# EasyEDA Pro project HNDX.eprj, schematic Schematic1_6
Board Name: 底板_4; Create Date: 2025-03-26; Page Name: P1; Project Name: GP; Schematic Name: Schematic1_6; Update Date: 2025-07-21; Company: 嘉立创EDA; Page Size: A4; Version: V1.0
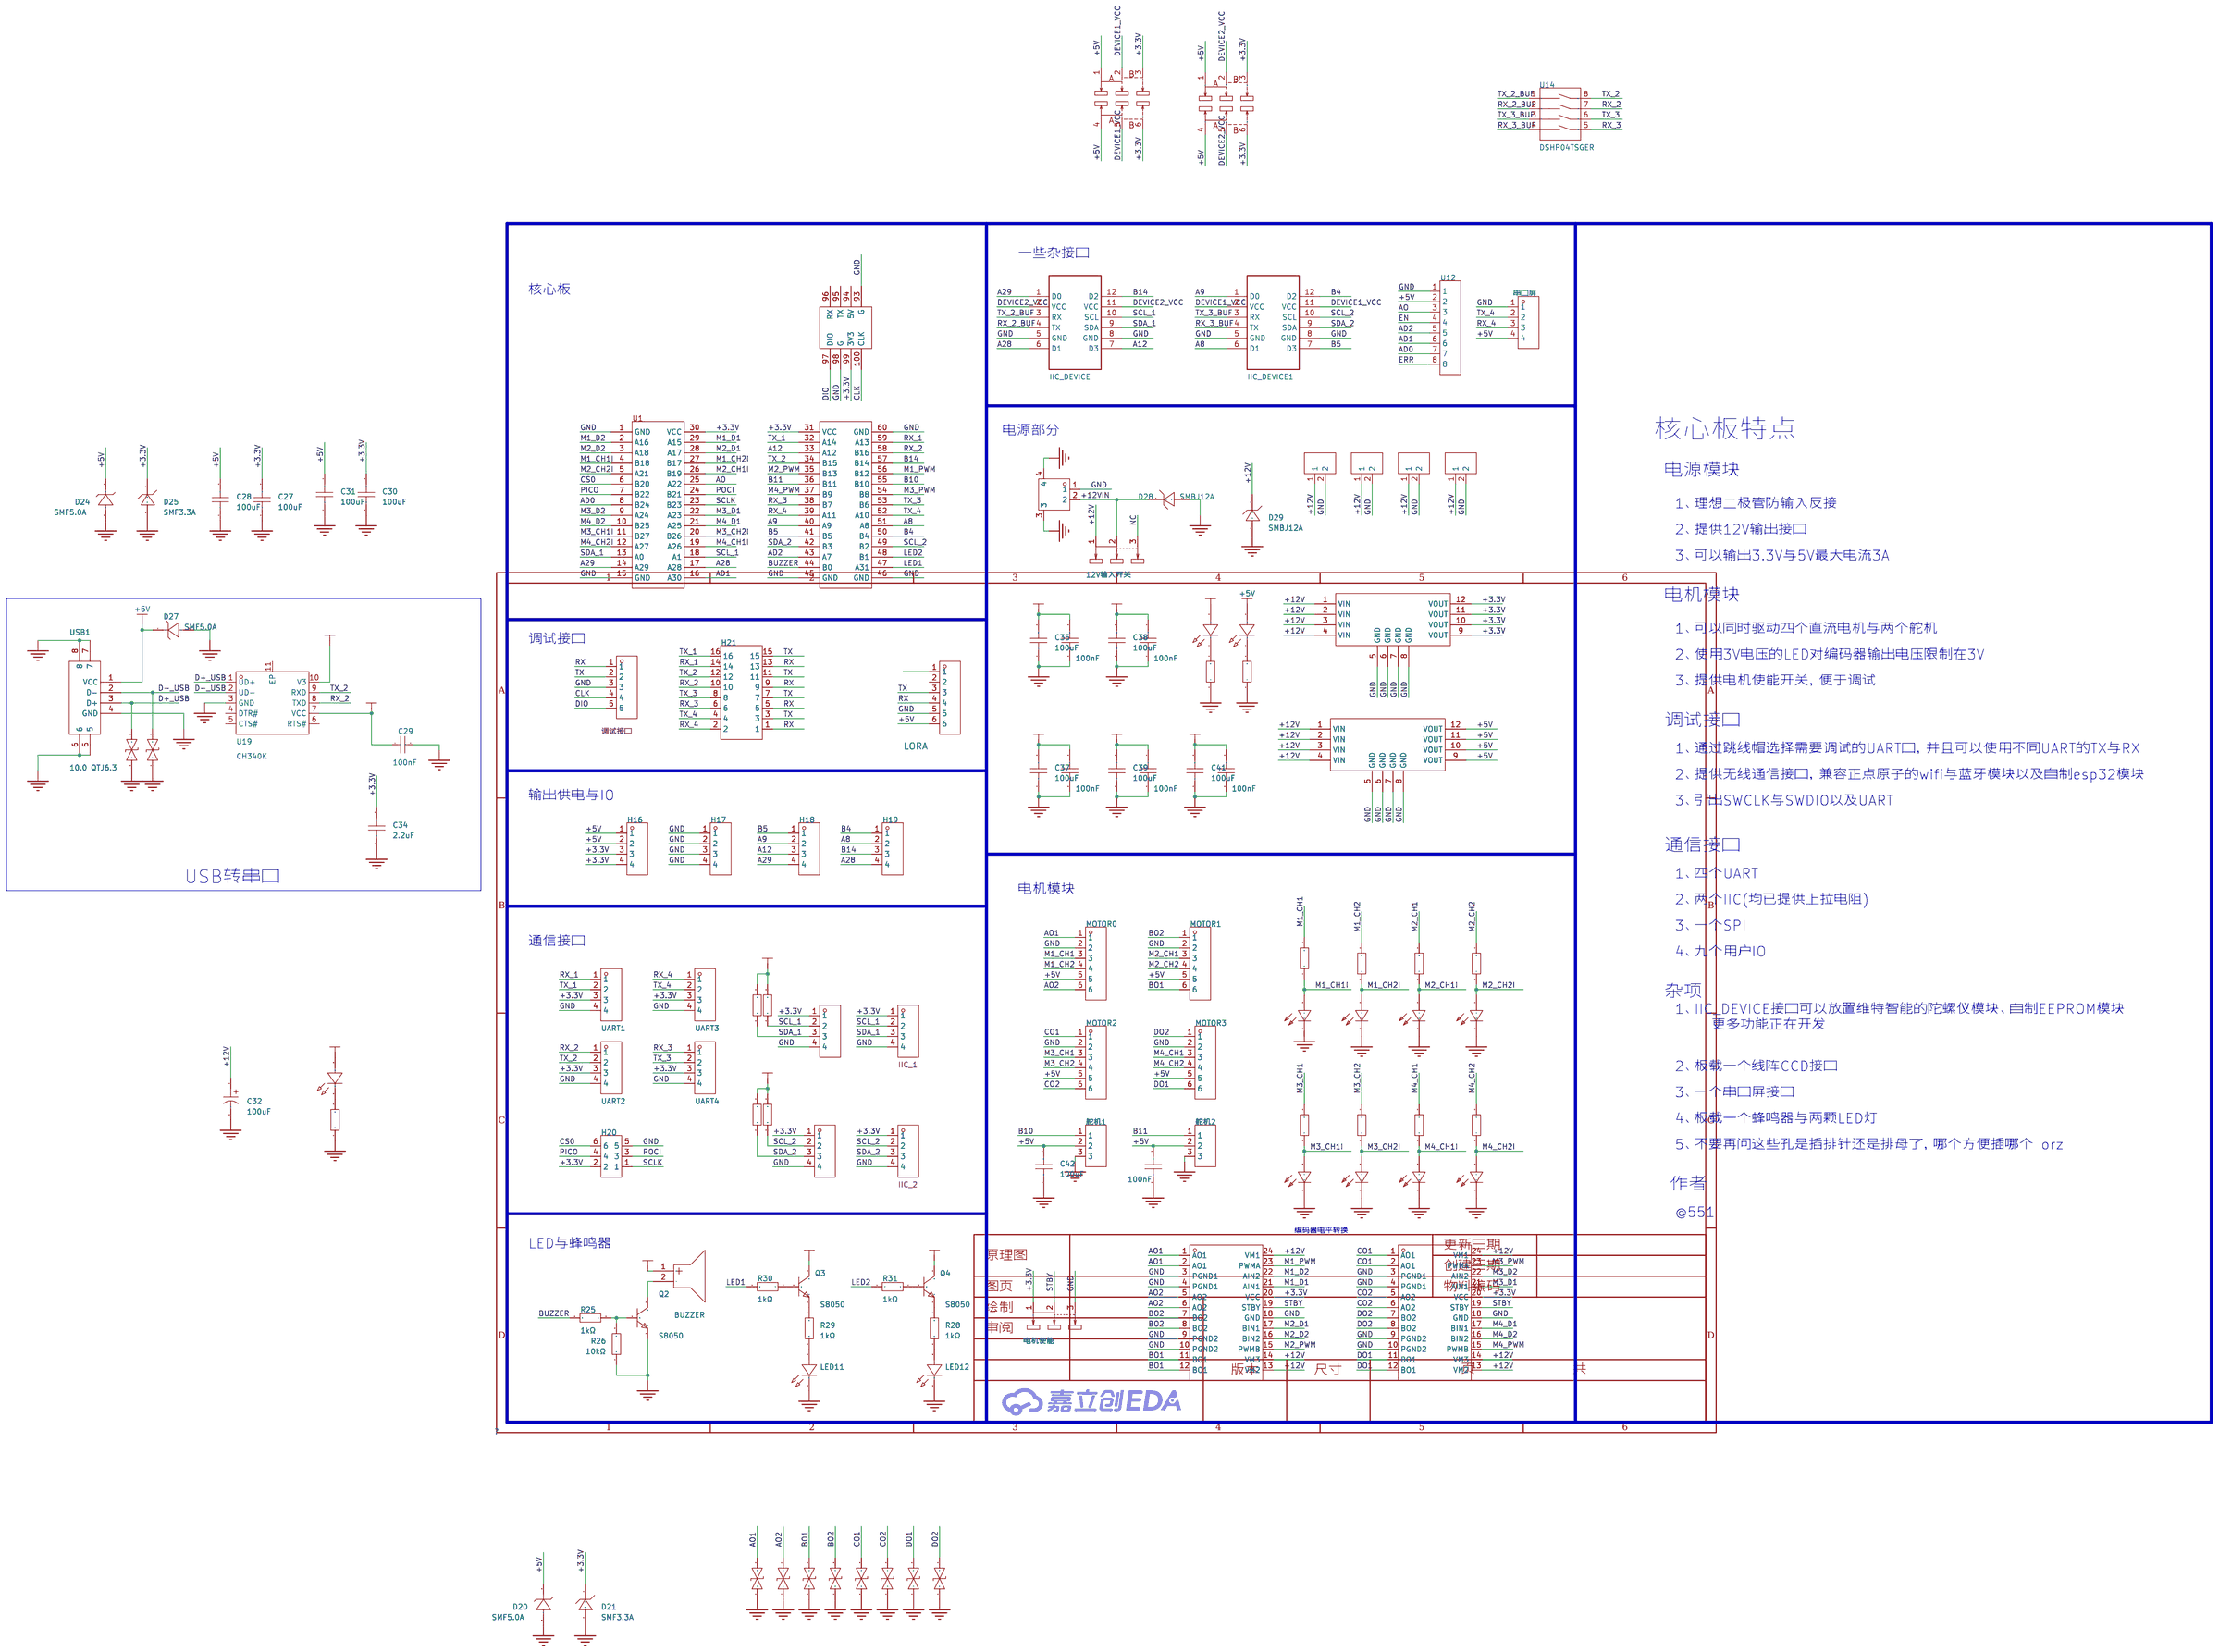
[diagram p4: schematic sheet]

## Parts
12V输入开关  SS-12D10L5  [SW-TH_SS-12D10L5]
BUZZER  2.7kHz  [BUZ-SMD_L9.6-W9.6-LS10.0-R]
C1  100nF  [C0603]
C7  100nF  [C0603]
C8  100nF  [C0603]
C11  100nF  [C0603]
C24  100nF  [C0603]
C26  100nF  [C0603]
C27  100uF  [C1210]
C28  100uF  [C1210]
C29  100nF  [C0603]
C30  100uF  [C1210]
C31  100uF  [C1210]
C32  100uF  [CAP-SMD_BD8.0-L8.3-W8.3-LS9.3-FD]
C34  2.2uF  [C0603]
C35  100uF  [C1210]
C37  100uF  [C1210]
C38  100uF  [C1210]
C39  100uF  [C1210]
C41  100uF  [C1210]
C42  100uF  [C1210]
CN1  XT30PW-M  [CONN-TH_XT30PW-M]
D7  0603ESDA-05N  [D0603-BI]
D20  SMF5.0A  [SOD-123FL_L2.7-W1.8-LS3.8-RD]
D21  SMF3.3A  [SOD-123_L2.8-W1.8-LS3.7-RD]
D24  SMF5.0A  [SOD-123FL_L2.7-W1.8-LS3.8-RD]
D25  SMF3.3A  [SOD-123_L2.8-W1.8-LS3.7-RD]
D26  0603ESDA-05N  [D0603-BI]
D27  SMF5.0A  [SOD-123FL_L2.7-W1.8-LS3.8-RD]
D28  SMBJ12A  [SMB_L4.3-W3.6-LS5.3-RD]
D29  SMBJ12A  [SMB_L4.3-W3.6-LS5.3-RD]
D30  SMF12CA  [SOD-123FL_L2.8-W1.8-LS3.7-BI]
D31  SMF12CA  [SOD-123FL_L2.8-W1.8-LS3.7-BI]
D33  SMF12CA  [SOD-123FL_L2.8-W1.8-LS3.7-BI]
D35  SMF12CA  [SOD-123FL_L2.8-W1.8-LS3.7-BI]
D36  SMF12CA  [SOD-123FL_L2.8-W1.8-LS3.7-BI]
D37  SMF12CA  [SOD-123FL_L2.8-W1.8-LS3.7-BI]
D38  SMF12CA  [SOD-123FL_L2.8-W1.8-LS3.7-BI]
D39  SMF12CA  [SOD-123FL_L2.8-W1.8-LS3.7-BI]
H1  UART2  [HDR-TH_4P-P2.54-V-M]
H2  UART1  [HDR-TH_4P-P2.54-V-M]
H8  UART3  [HDR-TH_4P-P2.54-V-M]
H9  UART4  [HDR-TH_4P-P2.54-V-M]
H11  PZ254V-11-04P  [HDR-TH_4P-P2.54-V-M]
H12  IIC_1  [HDR-TH_4P-P2.54-V-M]
H13  PZ254V-11-04P  [HDR-TH_4P-P2.54-V-M]
H14  IIC_2  [HDR-TH_4P-P2.54-V-M]
H16  PZ254V-11-04P  [HDR-TH_4P-P2.54-V-M]
H17  PZ254V-11-04P  [HDR-TH_4P-P2.54-V-M]
H18  PZ254V-11-04P  [HDR-TH_4P-P2.54-V-M]
H19  PZ254V-11-04P  [HDR-TH_4P-P2.54-V-M]
H20  PH2.54-07-03PWS  [HDR-TH_6P-P2.54-H-M-R2-C3-S2.54-W12.3-N]
H21  PZ254R-12-16P  [HDR-TH_16P-P2.54-H-M-R2-C8-S2.54]
IIC_DEVICE  -  [TUOLUOYI]
IIC_DEVICE1  -  [TUOLUOYI]
LED1  NCD0603R1  [LED0603-RD_RED]
LED2  NCD0603R1  [LED0603-RD_RED]
LED3  NCD0603R1  [LED0603-RD_RED]
LED4  NCD0603R1  [LED0603-RD_RED]
LED5  NCD0603R1  [LED0603-RD_RED]
LED6  NCD0603R1  [LED0603-RD_RED]
LED7  NCD0603R1  [LED0603-RD_RED]
LED8  NCD0603R1  [LED0603-RD_RED]
LED9  XL-1608UGC-04  [LED0603-RD_GREEN]
LED10  XL-1608UGC-04  [LED0603-RD_GREEN]
LED11  XL-3216SURC  [LED1206-R-RD_RED]
LED12  XL-3216SURC  [LED1206-R-RD_RED]
LED13  XL-1608UGC-04  [LED0603-RD_GREEN]
LORA  -  [HDR-TH_6P-P2.54-V-M]
MOTOR0  HX25003-6WAP  [CONN-TH_6P-P2.50_HX25003-6WAP]
MOTOR1  HX25003-6WAP  [CONN-TH_6P-P2.50_HX25003-6WAP]
MOTOR2  HX25003-6WAP  [CONN-TH_6P-P2.50_HX25003-6WAP]
MOTOR3  HX25003-6WAP  [CONN-TH_6P-P2.50_HX25003-6WAP]
Q2  S8050  [SOT-23-3_L2.9-W1.3-P1.90-LS2.3-BR]
Q3  S8050  [SOT-23-3_L2.9-W1.3-P1.90-LS2.3-BR]
Q4  S8050  [SOT-23-3_L2.9-W1.3-P1.90-LS2.3-BR]
R3  1k  [R0603]
R4  1k  [R0603]
R5  1k  [R0603]
R6  1k  [R0603]
R7  1k  [R0603]
R8  1k  [R0603]
R9  1k  [R0603]
R10  1k  [R0603]
R19  1kΩ  [R0603]
R20  1kΩ  [R0603]
R21  1kΩ  [R0603]
R22  1kΩ  [R0603]
R23  1k  [R0603]
R24  1k  [R0603]
R25  1kΩ  [R0603]
R26  10kΩ  [R0603]
R28  1kΩ  [R0603]
R29  1kΩ  [R0603]
R30  1kΩ  [R0603]
R31  1kΩ  [R0603]
R32  1k  [R0603]
SW2  MST22D18G2  [SW-SMD_MST22D18G2]
SW3  MST22D18G2  [SW-SMD_MST22D18G2]
U1  -  [mspm0gp]
U2  TB6612FNG(O,C,8,EL  [SSOP-24_L8.4-W5.8-P0.65-LS7.8-BL]
U3  TB6612FNG(O,C,8,EL  [SSOP-24_L8.4-W5.8-P0.65-LS7.8-BL]
U6  调试接口  [HDR-TH_5P-P2.54-V-M]
U10  -  [电源模块]
U11  -  [电源模块]
U12  BX-XH2.54-8PWZ  [CONN-TH_8P-P2.50_BX-XH2.54-8PWZ]
U14  DSHP04TSGER  [SW-SMD_8P-L6.7-W5.4-P1.27-LS8.4]
U15  DB125-2.54-2P-GN-S  [CONN-TH_DB125-2.54-2P-GN]
U16  DB125-2.54-2P-GN-S  [CONN-TH_DB125-2.54-2P-GN]
U17  DB125-2.54-2P-GN-S  [CONN-TH_DB125-2.54-2P-GN]
U18  DB125-2.54-2P-GN-S  [CONN-TH_DB125-2.54-2P-GN]
U19  CH340K  [ESOP-10_L4.9-W3.9-P1.00-LS6.2-BL-EP]
USB1  10.0 QTJ6.3  [USB-A-SMD_10.0-QTJ6.3]
串口屏  HX25003-4A  [CONN-TH_4P-P2.50_HX25003-4A]
电机使能  SS-12D10L5  [SW-TH_SS-12D10L5]
舵机1  PZ254V-11-03P  [HDR-TH_3P-P2.54-V-M]
舵机2  PZ254V-11-03P  [HDR-TH_3P-P2.54-V-M]

## Library data of the parts
12V输入开关 电机使能 = SS-12D10L5: 电路结构:单刀双掷;安装方式:直插;开关颜色:黑色;额定电流(DC):3A;额定电压(DC):125V;额定电流(AC):3A;额定电压(AC):125V;机械寿命:1万次;; LCSC Part Name: 柄长5mm 直插双档 滑动开关; Supplier Part: C319012; Manufacturer: XKB Connectivity(中国星坤); Supplier Footprint: 插件; JLCPCB Part Class: 扩展库; Datasheet: https://atta.szlcsc.com/upload/public/pdf/source/20211009/D6412F37AABE6F9459A6EE7FA4DAEADB.pdf; Supplier: LCSC; Circuit: 单刀双掷; Actuator Style: 矩形柱状; Pin Style: PC引脚; Switch Length: 13mm; Switch Width: 6.8mm; Switch Height: 6.4mm; Mounting Style: 直插; Actuator Color: 黑色; Current Rating (DC): 3A; Voltage Rating (DC): 125V; Current Rating (AC): 3A; Voltage Rating (AC): 125V; Mechanical Life: 1万次; Operating Temperature: -40℃~+85℃
BUZZER = YS-SBZ9650DYB05: LCSC Part Name: 贴片有源蜂鸣器5V; Supplier Part: C409830; Manufacturer: Fengming(锋鸣电子); Supplier Footprint: SMD,9.6x9.6mm; JLCPCB Part Class: 扩展库; Datasheet: https://atta.szlcsc.com/upload/public/pdf/source/20191217/C409830_8EC3C70066086F723D62F9967ED58A07.pdf; Supplier: LCSC; Oscillator Circuit: 有源(内含驱动线路); Operating Voltage: 3V~7V; Sound Pressure Level (SPL): 80dB@5V,10cm; Length: 9.6mm; Width: 9.6mm; Height: 5.3mm
C1 C7 C8 C11 C24 C26 = CGA0603X7R104K500JT: LCSC Part Name: 100nF ±10% 50V; Supplier Part: C6119867; Manufacturer: HRE(芯声); Supplier Footprint: 0603; JLCPCB Part Class: 扩展库; Supplier: LCSC; Tolerance: ±10%; Voltage Rated: 50V; Temperature Coefficient: X7R
C27 C28 C30 C31 C35 C37-C39 C41 C42 = GRM32ER61A107ME20L: LCSC Part Name: 100uF ±20% 10V; Supplier Part: C84455; Manufacturer: muRata(村田); Supplier Footprint: 1210; JLCPCB Part Class: 扩展库; Datasheet: https://atta.szlcsc.com/upload/public/pdf/source/20180228/C84455_15198056002791377611.pdf; Supplier: LCSC; Tolerance: ±20%; Voltage Rated: 10V; Temperature Coefficient: X5R
C29 = CAP_0603: Supplier Footprint: 0603
C32 = MA50V100M8X12: LCSC Part Name: 100uF ±20% 50V; Supplier Part: C46550475; Manufacturer: 捷而瑞; Supplier Footprint: SMD,D8xL12mm; JLCPCB Part Class: 扩展库; Datasheet: https://atta.szlcsc.com/upload/public/pdf/source/20250508/042504A8A2EFB60B30B9FCDBA41DB211.pdf; Supplier: LCSC; Tolerance: ±20%; Voltage Rating: 50V; Ripple Current: 3.1A@100Hz; Equivalent Series Resistance(ESR): 25mΩ@100kHz; Diameter: 8mm; Lifetime: 2000hrs@105℃; Operating Temperature: -55℃~+105℃
C34 = CL10A225KB8NNNC: 容值:2.2uF;精度:±10%;额定电压:50V;材质(温度系数):X5R;; LCSC Part Name: 2.2uF ±10% 50V; Supplier Part: C913904; Manufacturer: SAMSUNG(三星); Supplier Footprint: 0603; JLCPCB Part Class: 扩展库; Datasheet: https://atta.szlcsc.com/upload/public/pdf/source/20160218/1457707763339.pdf; Supplier: LCSC; Tolerance: ±10%; Voltage Rated: 50V; Temperature Coefficient: X5R
CN1 = XT30PW-M: LCSC Part Name: XT30PW-M公头; Supplier Part: C431092; Manufacturer: AMASS(艾迈斯); Supplier Footprint: Through Hole; JLCPCB Part Class: Extended Part; Datasheet: https://atta.szlcsc.com/upload/public/pdf/source/20220222/6A9F22F7850E25B33E1BE430ADF8560B.pdf; Supplier: LCSC
D7 D26 = 0603ESDA-05N: LCSC Part Name: 双向ESD; Supplier Part: C316054; Manufacturer: BORN(伯恩半导体); Supplier Footprint: 0603; JLCPCB Part Class: 扩展库; Datasheet: https://atta.szlcsc.com/upload/public/pdf/source/20200528/C316054_1CC523E9CE69E41C8DD5A05C832CCD1A.pdf; Supplier: LCSC; polarity: 双向; Reverse Stand-Off Voltage (Vrwm): 5V; Maximum Clamping Voltage: 50V; Type: ESD
D20 D24 D27 = SMF5.0A_C19077497: Supplier Part: C19077497; Manufacturer: 宏迦橙; Supplier Footprint: SOD-123FL; JLCPCB Part Class: 扩展库; Datasheet: https://atta.szlcsc.com/upload/public/pdf/source/20231129/4813F17DC56F8B344A8D004597B3633C.pdf; Supplier: LCSC; polarity: 单向; Reverse Stand-Off Voltage (Vrwm): 5V; Maximum Clamping Voltage: 7.3V; Peak Pulse Current (Ipp): 27.4A; Peak Pulse Power Dissipation (Ppp): 200W; Breakdown Voltage: 6.4V; Reverse Leakage Current (Ir): 400uA; Number of Lines: 单路; Operating Temperature: -55℃~+155℃; Type: TVS
D21 D25 = SMF3.3A_C283866: Supplier Part: C283866; Manufacturer: DOWO(东沃); Supplier Footprint: SOD-123FL; JLCPCB Part Class: 扩展库; Datasheet: https://atta.szlcsc.com/upload/public/pdf/source/20240321/1BA336232F2D97E4B026619682DB80D3.pdf; Supplier: LCSC; Reverse Stand-Off Voltage (Vrwm): 3.3V; Maximum Clamping Voltage: 8V; Peak Pulse Current (Ipp)@10/1000us: 25A; Breakdown Voltage: 5.2V; Reverse Leakage Current (Ir): 600uA; Type: TVS
D28 D29 = SMBJ12A_C19077565: Supplier Part: C19077565; Manufacturer: 宏嘉诚; Supplier Footprint: SMB; JLCPCB Part Class: 扩展库; Datasheet: https://atta.szlcsc.com/upload/public/pdf/source/20250107/474F05451FC8AB27D7FA0238914F96F6.pdf; Supplier: LCSC; Polarity: 单向; Reverse Stand-Off Voltage (Vrwm): 12V; Clamping Voltage: 19.9V; Peak Pulse Current (Ipp): 30.15A; Peak Pulse Power Dissipation (Ppp): 600W; Voltage - Breakdown: 14.7V; Reverse Leakage Current (Ir): 5uA; Type: TVS
D30 D31 D33 D35-D39 = SMF12CA_C19077507: Supplier Part: C19077507; Manufacturer: 宏迦橙; Supplier Footprint: SOD-123FL; JLCPCB Part Class: 扩展库; Datasheet: https://atta.szlcsc.com/upload/public/pdf/source/20231129/4813F17DC56F8B344A8D004597B3633C.pdf; Supplier: LCSC; polarity: 双向; Reverse Stand-Off Voltage (Vrwm): 12V; Maximum Clamping Voltage: 19.9V; Peak Pulse Current (Ipp)@10/1000us: 10.1A; Peak Pulse Power Dissipation (Ppp)@10/1000us: 200W; Breakdown Voltage: 14.7V; Reverse Leakage Current (Ir): 2.5uA; Operating Temperature: -55℃~+155℃; Type: TVS
H1 H2 H8 H9 H11-H14 H16-H19 = PZ254V-11-04P: 插针结构:1x4P;间距:2.54mm;行距:-;圆针/方针:方针;安装类型:直插;排数:单排;总PIN位数:4P;额定电流:3A;额定电压:250V;配合针长度:6mm;塑高:2.5mm;端接针长度:3mm;触头材质:-;工作温度范围:-40℃~+105℃;颜色:黑色;; LCSC Part Name: 间距:2.54mm 1x4P 直插 方针; Supplier Part: C2691448; Manufacturer: XFCN(兴飞); Supplier Footprint: 插件,P=2.54mm; JLCPCB Part Class: 扩展库; Datasheet: https://atta.szlcsc.com/upload/public/pdf/source/20200309/C492403_F9F19131791D08044AD4F84F8E751A34.pdf; Supplier: LCSC; Pin Structure: 1x4P; Pitch: 2.54mm; Circluar Pins/Square Pins: 方针; Mounting Type: 直插; Number of Rows: 单排; Number of Pins: 4P; Current Rating (Max): 3A; Voltage Rating (Max): 250V; Length of Mating Pin: 6mm; Insulation Height: 2.5mm; Length of End Connection Pin: 3mm; Operating Temperature Range: -40℃~+105℃; Color: 黑色
H20 = PH2.54-07-03PWS: LCSC Part Name: 2x3P 间距:2.54mm 方针 弯插; Supplier Part: C7501617; Manufacturer: XUNPU(讯普); Supplier Footprint: 弯插,P=2.54mm; JLCPCB Part Class: 扩展库; Datasheet: https://atta.szlcsc.com/upload/public/pdf/source/20241122/C715A738E7C0FD419A695A197092155B.pdf; Supplier: LCSC; Pin Structure: 2x3P; Pitch: 2.54mm; Circluar Pins/Square Pins: 方针; Mounting Type: 弯插; Number of Rows: 双排; Number of Pins: 6P; Length of Mating Pin: 6mm; Insulation Height: 2.5mm; Contact Material: 黄铜; Operating Temperature: -40℃~+105℃; Color: 黑色
H21 = PZ254R-12-16P: LCSC Part Name: 2x8P 间距:2.54mm 方针 弯插; Supplier Part: C492436; Manufacturer: XFCN(兴飞); Supplier Footprint: 弯插,P=2.54mm; JLCPCB Part Class: 扩展库; Datasheet: https://atta.szlcsc.com/upload/public/pdf/source/20200309/C492436_DD2BC8C297EFC04522424EFF5C609A1B.pdf; Supplier: LCSC; Pin Structure: 2x8P; Pitch: 2.54mm; Row Spacing: 2.54mm; Circluar Pins/Square Pins: 方针; Mounting Type: 弯插; Number of Rows: 双排; Number of Pins: 16P; Length of Mating Pin: 6mm; Insulation Height: 2.5mm; Contact Material: 黄铜; Operating Temperature: -40℃~+105℃; Color: 黑色
IIC_DEVICE IIC_DEVICE1 = TUOLUOYI: _: undefined
LED1-LED8 = NCD0603R1_C84263: 灯头类型:-;发光颜色:红色;正向电压(VF):1.6V~2.6V;功率:65mW;正向电流:20mA;主波长:615nm~630nm;二极管配置:独立二极管;透镜颜色:无色透明透镜;色温:-;发光强度:80mcd~220mcd;发光角度:130°;载带方式:-;工作温度:-30℃~+85℃;; Supplier Part: C84263; Manufacturer: 国星光电; Supplier Footprint: 0603; JLCPCB Part Class: 扩展库; Datasheet: https://atta.szlcsc.com/upload/public/pdf/source/20200820/C84263_DABC6A75E58F576973B407FDBA283D60.pdf; Supplier: LCSC; Emitted Color: 红色; Forward Voltage (VF): 1.6V~2.6V; Power Dissipation: 65mW; Forward Current: 20mA; Dominant Wavelength: 615nm~630nm; Diode Configuration: 独立二极管; Lens Color: 无色透明透镜; Luminous Intensity: 80mcd~220mcd; Viewing Angle: 130°; Operating Temperature: -30℃~+85℃
LED9 LED10 LED13 = XL-1608UGC-04: Supplier Part: C965804; Manufacturer: XINGLIGHT(成兴光); Supplier Footprint: 0603; JLCPCB Part Class: 扩展库; Datasheet: https://atta.szlcsc.com/upload/public/pdf/source/20221102/520D6E465E5CFD1609C8A4DBC80D4018.pdf; Supplier: LCSC; Emitted Color: 翠绿色; Power Dissipation: 80mW; Forward Current: 25mA; Dominant Wavelength: 516nm~525nm; Peak Wavelength: 534nm; Diode Configuration: 独立二极管; Lens Color: 无色透明透镜; Viewing Angle: 120°; Mounting Sytle: 正贴; Operating Temperature: -30℃~+85℃
LED11 LED12 = XL-3216SURC: Supplier Part: C965822; Manufacturer: XINGLIGHT(成兴光); Supplier Footprint: 1206; JLCPCB Part Class: 扩展库; Datasheet: https://atta.szlcsc.com/upload/public/pdf/source/20221102/38B682A5E5FDBBFCA7077B6272CE8E6F.pdf; Supplier: LCSC; Emitted Color: 红色; Power Dissipation: 55mW; Forward Current: 25mA; Dominant Wavelength: 617nm~621nm; Peak Wavelength: 623nm; Lens Color: 无色透明透镜; Viewing Angle: 120°; Mounting Sytle: 正贴; Operating Temperature: -30℃~+85℃
LORA = PZ254V-11-06P: 排数:单排;总PIN位数:6;间距:2.54mm;插针结构:1x6P;行距:-;安装类型:直插;圆针/方针:方针;额定电流:-;额定电压:-;配合针长度:6mm;塑高:2.5mm;端接针长度:3mm;触头材质:黄铜;触头镀层:-;工作温度范围:-40℃~+105℃;颜色:黑色;; LCSC Part Name: 2.54mm1x6P直插方针; Supplier Part: C492405; Manufacturer: XFCN(兴飞); Supplier Footprint: 插件,P=2.54mm; JLCPCB Part Class: ExtendedPart; Datasheet: https://atta.szlcsc.com/upload/public/pdf/source/20200309/C492405_597F1930F5B55CC3C7FD95458F1C3977.pdf; Supplier: LCSC; Number of Rows: 单排; Number of Pins: 6; Pitch: 2.54mm; Pin Structure: 1x6P; Mounting Type: 直插; Circluar Pins/Square Pins: 方针; Length of Mating Pin: 6mm; Insulation Height: 2.5mm; Length of End Connection Pin: 3mm; Contact Material: 黄铜; Operating Temperature Range: -40℃~+105℃; Color: 黑色
MOTOR0-MOTOR3 = HX25003-6WAP: LCSC Part Name: 1x6P 间距:2.5mm 弯插 系列:XH; Supplier Part: C442330; Manufacturer: HX(红星); Supplier Footprint: 弯插,P=2.5mm; JLCPCB Part Class: 扩展库; Datasheet: https://atta.szlcsc.com/upload/public/pdf/source/20191028/C442341_CB026E8ECE589085FA4A025D9CD8B44B.pdf; Supplier: LCSC; Pins Structure: 1x6P; Pitch: 2.5mm; Mounting Style: 弯插; Reference Series: XH; Number of Pins: 6P; Number of Rows: 1; Number of PINs Per Row: 6
Q2-Q4 = S8050_C20069125: LCSC Part Name: NPN 电流:500mA 耐压:25V; Supplier Part: C20069125; Manufacturer: 宏迦橙; Supplier Footprint: SOT-23; JLCPCB Part Class: 扩展库; Datasheet: https://atta.szlcsc.com/upload/public/pdf/source/20240403/2D78449C96B6E27F13BF8BDF79E27159.pdf; Supplier: LCSC; Transistor Type: NPN; Collector Current (Ic): 500mA; Collector-Emitter Breakdown Voltage (Vceo): 25V; Power Dissipation (Pd): 300mW; DC Current Gain (hFE@Ic,Vce): 120@50mA,1.0V; Transition Frequency (fT): 100MHz; Collector Cut-Off Current (Icbo): 100nA; Collector-Emitter Saturation Voltage (VCE(sat)@Ic,Ib): 600mV@500mA,50mA; Operating Temperature: -55℃~+150℃
R3-R10 R23 R24 R32 = 0603WAF2000T5E: 电阻类型:厚膜电阻;阻值:200Ω;精度:±1%;功率:100mW;最大工作电压:75V;温度系数:±100ppm/℃;; LCSC Part Name: 200Ω ±1% 100mW 厚膜电阻; Supplier Part: C8218; Manufacturer: UNI-ROYAL(厚声); Supplier Footprint: 0603; JLCPCB Part Class: 基础库; Datasheet: https://atta.szlcsc.com/upload/public/pdf/source/20200306/C422600_1E6D84923E4A46A82E41ADD87F860B5C.pdf; Supplier: LCSC; Type: 厚膜电阻; Tolerance: ±1%; Power(Watts): 100mW; Overload Voltage (Max): 75V; Temperature Coefficient: ±100ppm/℃; Operating Temperature Range: -55℃~+155℃
R19-R22 R25 R28-R31 = 0603WAF1001T5E: 电阻类型:厚膜电阻;阻值:1kΩ;精度:±1%;功率:100mW;最大工作电压:75V;温度系数:±100ppm/℃;; LCSC Part Name: 1kΩ ±1% 100mW 厚膜电阻; Supplier Part: C21190; Manufacturer: UNI-ROYAL(厚声); Supplier Footprint: 0603; JLCPCB Part Class: 基础库; Datasheet: https://atta.szlcsc.com/upload/public/pdf/source/20200306/C422600_1E6D84923E4A46A82E41ADD87F860B5C.pdf; Supplier: LCSC; Type: 厚膜电阻; Tolerance: ±1%; Power(Watts): 100mW; Overload Voltage (Max): 75V; Temperature Coefficient: ±100ppm/℃; Operating Temperature Range: -55℃~+155℃
R26 = 0603WAF1002T5E: LCSC Part Name: 厚膜电阻 10kΩ ±1% 100mW; Supplier Part: C25804; Manufacturer: UNI-ROYAL(厚声); Supplier Footprint: 0603; JLCPCB Part Class: 基础库; Datasheet: https://atta.szlcsc.com/upload/public/pdf/source/20200306/C422600_1E6D84923E4A46A82E41ADD87F860B5C.pdf; Supplier: LCSC; Type: 厚膜电阻; Tolerance: ±1%; Power(Watts): 100mW; Overload Voltage (Max): 75V; Temperature Coefficient: ±100ppm/℃; Operating Temperature Range: -55℃~+155℃
SW2 SW3 = MST22D18G2: LCSC Part Name: 两档立式贴片 6脚拨动 柄长2.0MM; Supplier Part: C431544; Manufacturer: SHOU HAN(首韩); Supplier Footprint: SMD,3.6x9.1mm; JLCPCB Part Class: 扩展库; Datasheet: https://atta.szlcsc.com/upload/public/pdf/source/20190925/C431544_D32DFFD935A96A6C5145903882D4ABA1.pdf; Supplier: LCSC; Circuit: 双刀双掷; Pin Style: SMD接片; Switch Length: 9.1mm; Switch Width: 3.6mm; Switch Height: 3.45mm; Mounting Style: 立贴; Current Rating (DC): 50mA; Voltage Rating (DC): 12V; Mechanical Life: 1万次; Operating Temperature: -30℃~+80℃
U1 = mspm0GP
U2 U3 = TB6612FNG(O,C,8,EL: Supplier Part: C88224; Manufacturer: TOSHIBA(东芝); Supplier Footprint: SSOP-24-208mil; JLCPCB Part Class: 扩展库; Datasheet: https://atta.szlcsc.com/upload/public/pdf/source/20171128/C141517_15118625624231147036.pdf; Supplier: LCSC
U6 = HB-PH3-25415PB2GOP: LCSC Part Name: 间距:2.54mm 1x5P 直插 方针; Supplier Part: C6332198; Manufacturer: HANBO(汉博); Supplier Footprint: 插件,P=2.54mm; JLCPCB Part Class: 扩展库; Datasheet: https://atta.szlcsc.com/upload/public/pdf/source/20230803/F72D259687963761DF1B552F3BB84A31.pdf; Supplier: LCSC; Pin Structure: 1x5P; Pitch: 2.54mm; Row Spacing: 2.54mm; Circluar Pins/Square Pins: 方针; Mounting Type: 直插; Number of Rows: 单排; Number of Pins: 5P; Current Rating (Max): 3A; Voltage Rating (Max): 250V; Length of Mating Pin: 6mm; Insulation Height: 2.54mm; Length of End Connection Pin: 3mm; Contact Material: 黄铜; Contact Plating: 金; Operating Temperature Range: -40℃~+105℃; Soldering Temperature(Max): 260℃; Color: 黑色
U10 U11 = 电源模块
U12 = BX-XH2.54-8PWZ: LCSC Part Name: 1x8P 间距:2.5mm 弯插 系列:XH; Supplier Part: C18077848; Manufacturer: Bossie(博锡); Supplier Footprint: 弯插,P=2.54mm; JLCPCB Part Class: 扩展库; Datasheet: https://atta.szlcsc.com/upload/public/pdf/source/20231017/41AC97E47A986FC17CA1415D1E63C8BA.pdf; Supplier: LCSC; Pins Structure: 1x8P; Pitch: 2.5mm; Mounting Type: 弯插; Reference Series: XH; Number of Pins: 8P; Number of Rows: 1; Number of PINs Per Row: 8; Current Rating: 3A; Contact Material: 黄铜; Contact Plating: 锡; Operating Temperature: -25℃~+85℃; Voltage Rating: 250V; Plastic Material: PA66; Flame Retardant Rating: UL94V-0; Color: 白色; Z-Height of the Board: 5.9mm; X-Length of Bottom Edge on Board (Spacing Line): 22.5mm; Y-Width of Bottom Edge on Board: 7.32mm
U14 = DSHP04TSGER_C3293144: LCSC Part Name: 4位 1.27mm间距贴片型 KE拨码开关; Supplier Part: C3293144; Manufacturer: 康深; Supplier Footprint: SMD-8P,5.4x6.6mm; JLCPCB Part Class: 扩展库; Datasheet: https://atta.szlcsc.com/upload/public/pdf/source/20220713/C53382FBC579242FFD9AC69EAEDF7542.pdf; Supplier: LCSC; Circuit: 单刀单掷; Number of Positions: 4位; Lead Pitch: 1.27mm; Current Rating: 25mA; Voltage Rating: 24V; Operating Temperature: -30℃~+85℃; Operating Life: 3千次; Color: 黑色
U15-U18 = DB125-2.54-2P-GN-S: LCSC Part Name: 1x2P 2.54mm 直插 排数:1 每排P数:2; Supplier Part: C918120; Manufacturer: DORABO(地博电气); Supplier Footprint: 插件,P=2.54mm; JLCPCB Part Class: 扩展库; Datasheet: https://atta.szlcsc.com/upload/public/pdf/source/20230106/BCD3A0BE1EB95DC3E813F1745F022035.pdf; Supplier: LCSC; Number of Positions or Pins: 1x2P; Pitch: 2.54mm; Color: 绿色; Mounting Type: 直插; Number of Pins: 2P; Number of Rows: 1; Number of PINs Per Row: 2; Current Rating: 7A; Voltage Rating (Max): 150V; Wire Gauge - AWG: 18~26; Wire Gauge - mm2: 1; Operating Temperature: -40℃~+105℃
U19 = CH340K: LCSC Part Name: USB转串口芯片CH340; Supplier Part: C968586; Manufacturer: WCH(南京沁恒); Supplier Footprint: ESSOP-10-150mil-1mm; JLCPCB Part Class: 扩展库; Datasheet: https://atta.szlcsc.com/upload/public/pdf/source/20240313/C21A12AB66F63ABF8F8743FF13A35C95.pdf; Supplier: LCSC; Applications Function: USB转串口; Protocol: USB 2.0; Voltage - Supply: 3.3V；5V; Data Rate: 2Mbps; Operating Temperature: -20℃~+70℃
USB1 = 10.0 QTJ6.3: LCSC Part Name: Type-A 母 卧贴; Supplier Part: C404966; Manufacturer: SHOU HAN(首韩); Supplier Footprint: SMD; JLCPCB Part Class: 扩展库; Datasheet: https://atta.szlcsc.com/upload/public/pdf/source/20241125/0CEA21D77C128715D5877707589FFAD8.pdf; Supplier: LCSC; Connector Type: Type-A; Standard: USB 2.0; Gender: 母; Mounting Style: 卧贴; Number of Contacts: 4P; Number of Ports: 1; Current Rating - Power (Max): 1.5A; Rated Voltage (Max): 30V; Connect-Disconnect Life: 5千次; Length: 10mm; Core Colour: 黑色; Operating Temperature Range: -25℃~+85℃
串口屏 = HX25003-4A: 插针结构:1x4P;间距:2.5mm;安装方式:直插;参考系列:XH;总PIN数:4P;排数:1;每排PIN数:4;行距:-;额定电流:-;工作温度范围:-;; LCSC Part Name: 1x4P 间距:2.5mm 直插 系列:XH; Supplier Part: C442301; Manufacturer: HX(红星); Supplier Footprint: 插件,P=2.5mm; JLCPCB Part Class: 扩展库; Datasheet: https://atta.szlcsc.com/upload/public/pdf/source/20191028/C442312_1520F9194999EF6509032948661325F7.pdf; Supplier: LCSC; Pins Structure: 1x4P; Pitch: 2.5mm; Mounting Style: 直插; Reference Series: XH; Number of Pins: 4P; Number of Rows: 1; Number of PINs Per Row: 4
舵机1 舵机2 = PZ254V-11-03P: 排数:单排;总PIN位数:3;间距:2.54mm;插针结构:1x3P;行距:-;安装类型:直插;圆针/方针:方针;额定电流:3A;额定电压:250V;配合针长度:6mm;塑高:2.5mm;端接针长度:3mm;工作温度范围:-40℃~+105℃;颜色:黑色;; LCSC Part Name: 2.54mm1x3P直插方针; Supplier Part: C2937625; Manufacturer: XFCN(兴飞); Supplier Footprint: 直插,P=2.54mm; JLCPCB Part Class: ExtendedPart; Datasheet: https://atta.szlcsc.com/upload/public/pdf/source/20200309/C492402_8335C3D49C4E4C618838D59BB1D024C1.pdf; Supplier: LCSC; Number of Rows: 单排; Number of Pins: 3; Pitch: 2.54mm; Pin Structure: 1x3P; Mounting Type: 直插; Circluar Pins/Square Pins: 方针; Current Rating (Max): 3A; Voltage Rating (Max): 250V; Length of Mating Pin: 6mm; Insulation Height: 2.5mm; Length of End Connection Pin: 3mm; Operating Temperature Range: -40℃~+105℃; Color: 黑色

## Nets
+3.3V: BUZZER.1(+) C1.1 C8.1 C26.1 C27.2 C29.1 C30.2 C34.2 C37.2 C39.2 C41.2 D21.1 D25.1 H1.3 H2.3 H8.3 H9.3 H11.1 H12.1 H13.1 H14.1 H16.3 H16.4 H20.2 LED9.2(A) Q3.3(C) Q4.3(C) R19.2 R20.2 R21.2 R22.2 SW2.3 SW2.6 SW3.3 SW3.6 U1.30(VCC) U1.31(VCC) U1.99(3V3) U2.20(VCC) U3.20(VCC) U11.9(VOUT) U11.10(VOUT) U11.11(VOUT) U11.12(VOUT) U19.7(VCC) U19.10(V3) 电机使能.1
+5V: C24.1 C28.2 C31.2 C42.2 D20.1(K) D24.1(K) D27.1(K) H16.1 H16.2 LED10.2(A) LORA.6 MOTOR0.5 MOTOR1.5 MOTOR2.5 MOTOR3.5 SW2.1 SW2.4 SW3.1 SW3.4 U10.9(VOUT) U10.10(VOUT) U10.11(VOUT) U10.12(VOUT) U12.2 USB1.1(VCC) 串口屏.4 舵机1.2 舵机2.2
+12V: 12V输入开关.1 C7.1 C11.1 C32.1 C35.2 C38.2 D29.1 U2.13(VM2) U2.14(VM3) U2.24(VM1) U3.13(VM2) U3.14(VM3) U3.24(VM1) U10.1(VIN) U10.2(VIN) U10.3(VIN) U10.4(VIN) U11.1(VIN) U11.2(VIN) U11.3(VIN) U11.4(VIN) U15.1 U16.1 U17.1 U18.1
+12VIN: 12V输入开关.2 CN1.2 D28.1 LED13.2(A)
GND: C1.2 C7.2 C8.2 C11.2 C24.2 C26.2 C27.1 C28.1 C29.2 C30.1 C31.1 C32.2 C34.1 C35.1 C37.1 C38.1 C39.1 C41.1 C42.1 CN1.1 CN1.3 CN1.4 D7.1 D20.2(A) D21.2 D24.2(A) D25.2 D26.1 D27.2(A) D28.2 D29.2 D30.1 D31.1 D33.1 D35.1 D36.1 D37.1 D38.1 D39.1 H1.4 H2.4 H8.4 H9.4 H11.4 H12.4 H13.4 H14.4 H17.1 H17.2 H17.3 H17.4 H20.5 IIC_DEVICE.5(GND) IIC_DEVICE.8(GND) IIC_DEVICE1.5(GND) IIC_DEVICE1.8(GND) LED1.1(K) LED2.1(K) LED3.1(K) LED4.1(K) LED5.1(K) LED6.1(K) LED7.1(K) LED8.1(K) LED11.2(A) LED12.2(A) LORA.5 MOTOR0.2 MOTOR1.2 MOTOR2.2 MOTOR3.2 Q2.2(E) R23.1 R24.1 R26.1 R32.1 U1.1(GND) U1.15(GND) U1.45(GND) U1.46(GND) U1.60(GND) U1.93(G) U1.98(G) U2.3(PGND1) U2.4(PGND1) U2.9(PGND2) U2.10(PGND2) U2.18(GND) U3.3(PGND1) U3.4(PGND1) U3.9(PGND2) U3.10(PGND2) U3.18(GND) U6.3 U10.5(GND) U10.6(GND) U10.7(GND) U10.8(GND) U11.5(GND) U11.6(GND) U11.7(GND) U11.8(GND) U12.1 U15.2 U16.2 U17.2 U18.2 U19.3(GND) USB1.4(GND) USB1.5 USB1.6 USB1.7 USB1.8 串口屏.1 电机使能.3 舵机1.3 舵机2.3
A8: H19.2 IIC_DEVICE1.6(D1) U1.51(A8)
A9: H18.2 IIC_DEVICE1.1(D0) U1.40(A9)
A12: H18.3 IIC_DEVICE.7(D3) U1.33(A12)
A28: H19.4 IIC_DEVICE.6(D1) U1.17(A28)
A29: H18.4 IIC_DEVICE.1(D0) U1.14(A29)
AD0: U1.8(B24) U12.7
AD1: U1.16(A30) U12.6
AD2: U1.43(A7) U12.5
AO: U1.25(A22) U12.3
AO1: D30.2 MOTOR0.1 U2.1(AO1) U2.2(AO1)
AO2: D31.2 MOTOR0.6 U2.5(AO2) U2.6(AO2)
B4: H19.1 IIC_DEVICE1.12(D2) U1.50(B4)
B5: H18.1 IIC_DEVICE1.7(D3) U1.41(B5)
B10: U1.55(B10) 舵机1.1
B11: U1.36(B11) 舵机2.1
B14: H19.3 IIC_DEVICE.12(D2) U1.57(B14)
BO1: D35.2 MOTOR1.6 U2.11(BO1) U2.12(BO1)
BO2: D33.2 MOTOR1.1 U2.7(BO2) U2.8(BO2)
BUZZER: R25.2 U1.44(B0)
CLK: U1.100(CLK) U6.4
CO1: D36.2 MOTOR2.1 U3.1(AO1) U3.2(AO1)
CO2: D37.2 MOTOR2.6 U3.5(AO2) U3.6(AO2)
CS0: H20.6 U1.6(B20)
D+_USB: D7.2 U19.1(UD+) USB1.3(D+)
D-_USB: D26.2 U19.2(UD-) USB1.2(D-)
DEVICE1_VCC: IIC_DEVICE1.2(VCC) IIC_DEVICE1.11(VCC) SW3.2 SW3.5
DEVICE2_VCC: IIC_DEVICE.2(VCC) IIC_DEVICE.11(VCC) SW2.2 SW2.5
DIO: U1.97(DIO) U6.5
DO1: D38.2 MOTOR3.6 U3.11(BO1) U3.12(BO1)
DO2: D39.2 MOTOR3.1 U3.7(BO2) U3.8(BO2)
EN: U12.4
ERR: U12.8
LED1: R30.2 U1.47(A31)
LED2: R31.2 U1.48(B1)
M1_CH1: MOTOR0.3 R3.2
M1_CH1I: LED1.2(A) R3.1 U1.4(B18)
M1_CH2: MOTOR0.4 R4.2
M1_CH2I: LED2.2(A) R4.1 U1.27(B17)
M1_D1: U1.29(A15) U2.21(AIN1)
M1_D2: U1.2(A16) U2.22(AIN2)
M1_PWM: U1.56(B12) U2.23(PWMA)
M2_CH1: MOTOR1.3 R5.2
M2_CH1I: LED3.2(A) R5.1 U1.26(B19)
M2_CH2: MOTOR1.4 R6.2
M2_CH2I: LED4.2(A) R6.1 U1.5(A21)
M2_D1: U1.28(A17) U2.17(BIN1)
M2_D2: U1.3(A18) U2.16(BIN2)
M2_PWM: U1.35(B13) U2.15(PWMB)
M3_CH1: MOTOR2.3 R7.2
M3_CH1I: LED5.2(A) R7.1 U1.11(B27)
M3_CH2: MOTOR2.4 R8.2
M3_CH2I: LED6.2(A) R8.1 U1.20(B26)
M3_D1: U1.22(A23) U3.21(AIN1)
M3_D2: U1.9(A24) U3.22(AIN2)
M3_PWM: U1.54(B8) U3.23(PWMA)
M4_CH1: MOTOR3.3 R9.2
M4_CH1I: LED7.2(A) R9.1 U1.19(A26)
M4_CH2: MOTOR3.4 R10.2
M4_CH2I: LED8.2(A) R10.1 U1.12(A27)
M4_D1: U1.21(A25) U3.17(BIN1)
M4_D2: U1.10(B25) U3.16(BIN2)
M4_PWM: U1.37(B9) U3.15(PWMB)
NC: 12V输入开关.3
PICO: H20.4 U1.7(B22)
POCI: H20.3 U1.24(B21)
RX: H21.1 H21.5 H21.9 H21.13 LORA.4 U6.1
RX_1: H2.1 H21.14 U1.59(A13)
RX_2: H1.1 H21.10 U1.58(B16) U14.7 U19.8(TXD)
RX_2_BUF: IIC_DEVICE.4(TX) U14.2
RX_3: H9.1 H21.6 U1.38(B7) U14.5
RX_3_BUF: IIC_DEVICE1.4(TX) U14.4
RX_4: H8.1 H21.2 U1.39(A11) 串口屏.3
SCL_1: H11.2 H12.2 IIC_DEVICE.10(SCL) R20.1 U1.18(A1)
SCL_2: H13.2 H14.2 IIC_DEVICE1.10(SCL) R22.1 U1.49(B2)
SCLK: H20.1 U1.23(B23)
SDA_1: H11.3 H12.3 IIC_DEVICE.9(SDA) R19.1 U1.13(A0)
SDA_2: H13.3 H14.3 IIC_DEVICE1.9(SDA) R21.1 U1.42(B3)
STBY: U2.19(STBY) U3.19(STBY) 电机使能.2
TX: H21.3 H21.7 H21.11 H21.15 LORA.3 U6.2
TX_1: H2.2 H21.16 U1.32(A14)
TX_2: H1.2 H21.12 U1.34(B15) U14.8 U19.9(RXD)
TX_2_BUF: IIC_DEVICE.3(RX) U14.1
TX_3: H9.2 H21.8 U1.53(B6) U14.6
TX_3_BUF: IIC_DEVICE1.3(RX) U14.3
TX_4: H8.2 H21.4 U1.52(A10) 串口屏.2
$1N29621: LED9.1(K) R23.2
$1N29660: LED10.1(K) R24.2
$1N32545: BUZZER.2(-) Q2.3(C)
$1N32698: Q2.1(B) R25.1 R26.2
$1N33256: Q4.2(E) R28.1
$1N33295: Q3.2(E) R29.1
$1N33338: Q3.1(B) R30.1
$1N33377: Q4.1(B) R31.1
$1N131452: LED11.1(K) R29.2
$1N131457: LED12.1(K) R28.2
$1N135090: LED13.1(K) R32.2

Not connected (* = marked no-connect by the designer): LORA 1 2; U1 94(5V) 95(TX) 96(RX); U19 4(DTR#) 5(CTS#) 6(RTS#) 11(EP)

## Notes on the sheet
- 一些杂接口
- 核心板
- 电源部分
- 核心板特点
- 电源模块
- 1、理想二极管防输入反接
- 2、提供12V输出接口
- 3、可以输出3.3V与5V最大电流3A
- 电机模块
- 1、可以同时驱动四个直流电机与两个舵机
- 调试接口
- 2、使用3V电压的LED对编码器输出电压限制在3V
- 3、提供电机使能开关，便于调试
- 调试接口
- 1、通过跳线帽选择需要调试的UART口，并且可以使用不同UART的TX与RX
- 2、提供无线通信接口，兼容正点原子的wifi与蓝牙模块以及自制esp32模块
- 输出供电与IO
- 3、引出SWCLK与SWDIO以及UART
- 通信接口
- 1、四个UART
- USB转串口
- 电机模块
- 2、两个IIC(均已提供上拉电阻)
- 3、一个SPI
- 通信接口
- 4、九个用户IO
- 杂项
- 1、IIC_DEVICE接口可以放置维特智能的陀螺仪模块、自制EEPROM模块
       更多功能正在开发
- 2、板载一个线阵CCD接口
- 3、一个串口屏接口
- 4、板载一个蜂鸣器与两颗LED灯
- 5、不要再问这些孔是插排针还是排母了，哪个方便插哪个 orz
- 作者
- @551
- 编码器电平转换
- LED与蜂鸣器
